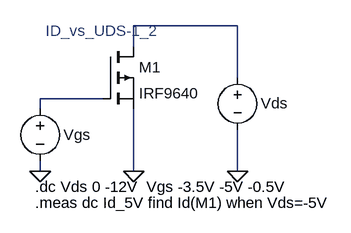
[diagram p0: schematic ID_vs_UDS-1_2.asc]
ID_vs_UDS-1_2.asc, the LTspice schematic file:
Version 4
SHEET 1 1292 680
WIRE -560 -96 -720 -96
WIRE -720 -64 -720 -96
WIRE -560 -16 -560 -96
WIRE -768 16 -864 16
WIRE -864 32 -864 16
WIRE -864 128 -864 112
WIRE -720 128 -720 32
WIRE -560 128 -560 64
FLAG -560 128 0
FLAG -864 128 0
FLAG -720 128 0
SYMBOL voltage -560 -32 R0
WINDOW 123 0 0 Left 2
WINDOW 39 37 60 Left 2
WINDOW 0 36 55 Left 2
WINDOW 3 37 60 Left 2
SYMATTR InstName Vds
SYMATTR Value ""
SYMBOL voltage -864 16 R0
WINDOW 123 0 0 Left 2
WINDOW 39 40 53 Left 2
WINDOW 3 40 69 Left 2
WINDOW 0 36 56 Left 2
SYMATTR Value ""
SYMATTR InstName Vgs
SYMBOL pmos -768 -64 R0
SYMATTR InstName M1
SYMATTR Value IRF9640
TEXT -872 152 Left 2 !.dc Vds 0 -12V  Vgs -3.5V -5V -0.5V
TEXT -872 176 Left 2 !.meas dc Id_5V find Id(M1) when Vds=-5V
TEXT -856 -88 Left 2 ;ID_vs_UDS-1_2

The netlist it stands for:
* ID_vs_UDS-1_2.asc
Vds N001 0
Vgs N002 0
M1 N001 N002 0 0 IRF9640
.model NMOS NMOS
.model PMOS PMOS
.lib standard.mos
.dc Vds 0 -12V  Vgs -3.5V -5V -0.5V
.meas dc Id_5V find Id(M1) when Vds=-5V
* ID_vs_UDS-1_2
.backanno
.end